# EasyEDA schematic schematic.json
TITLE: Sheet_1; REV: 1.0; Date: 2025-04-03; Sheet: 1/1; Drawn By: sahilchess09; Company: Your Company
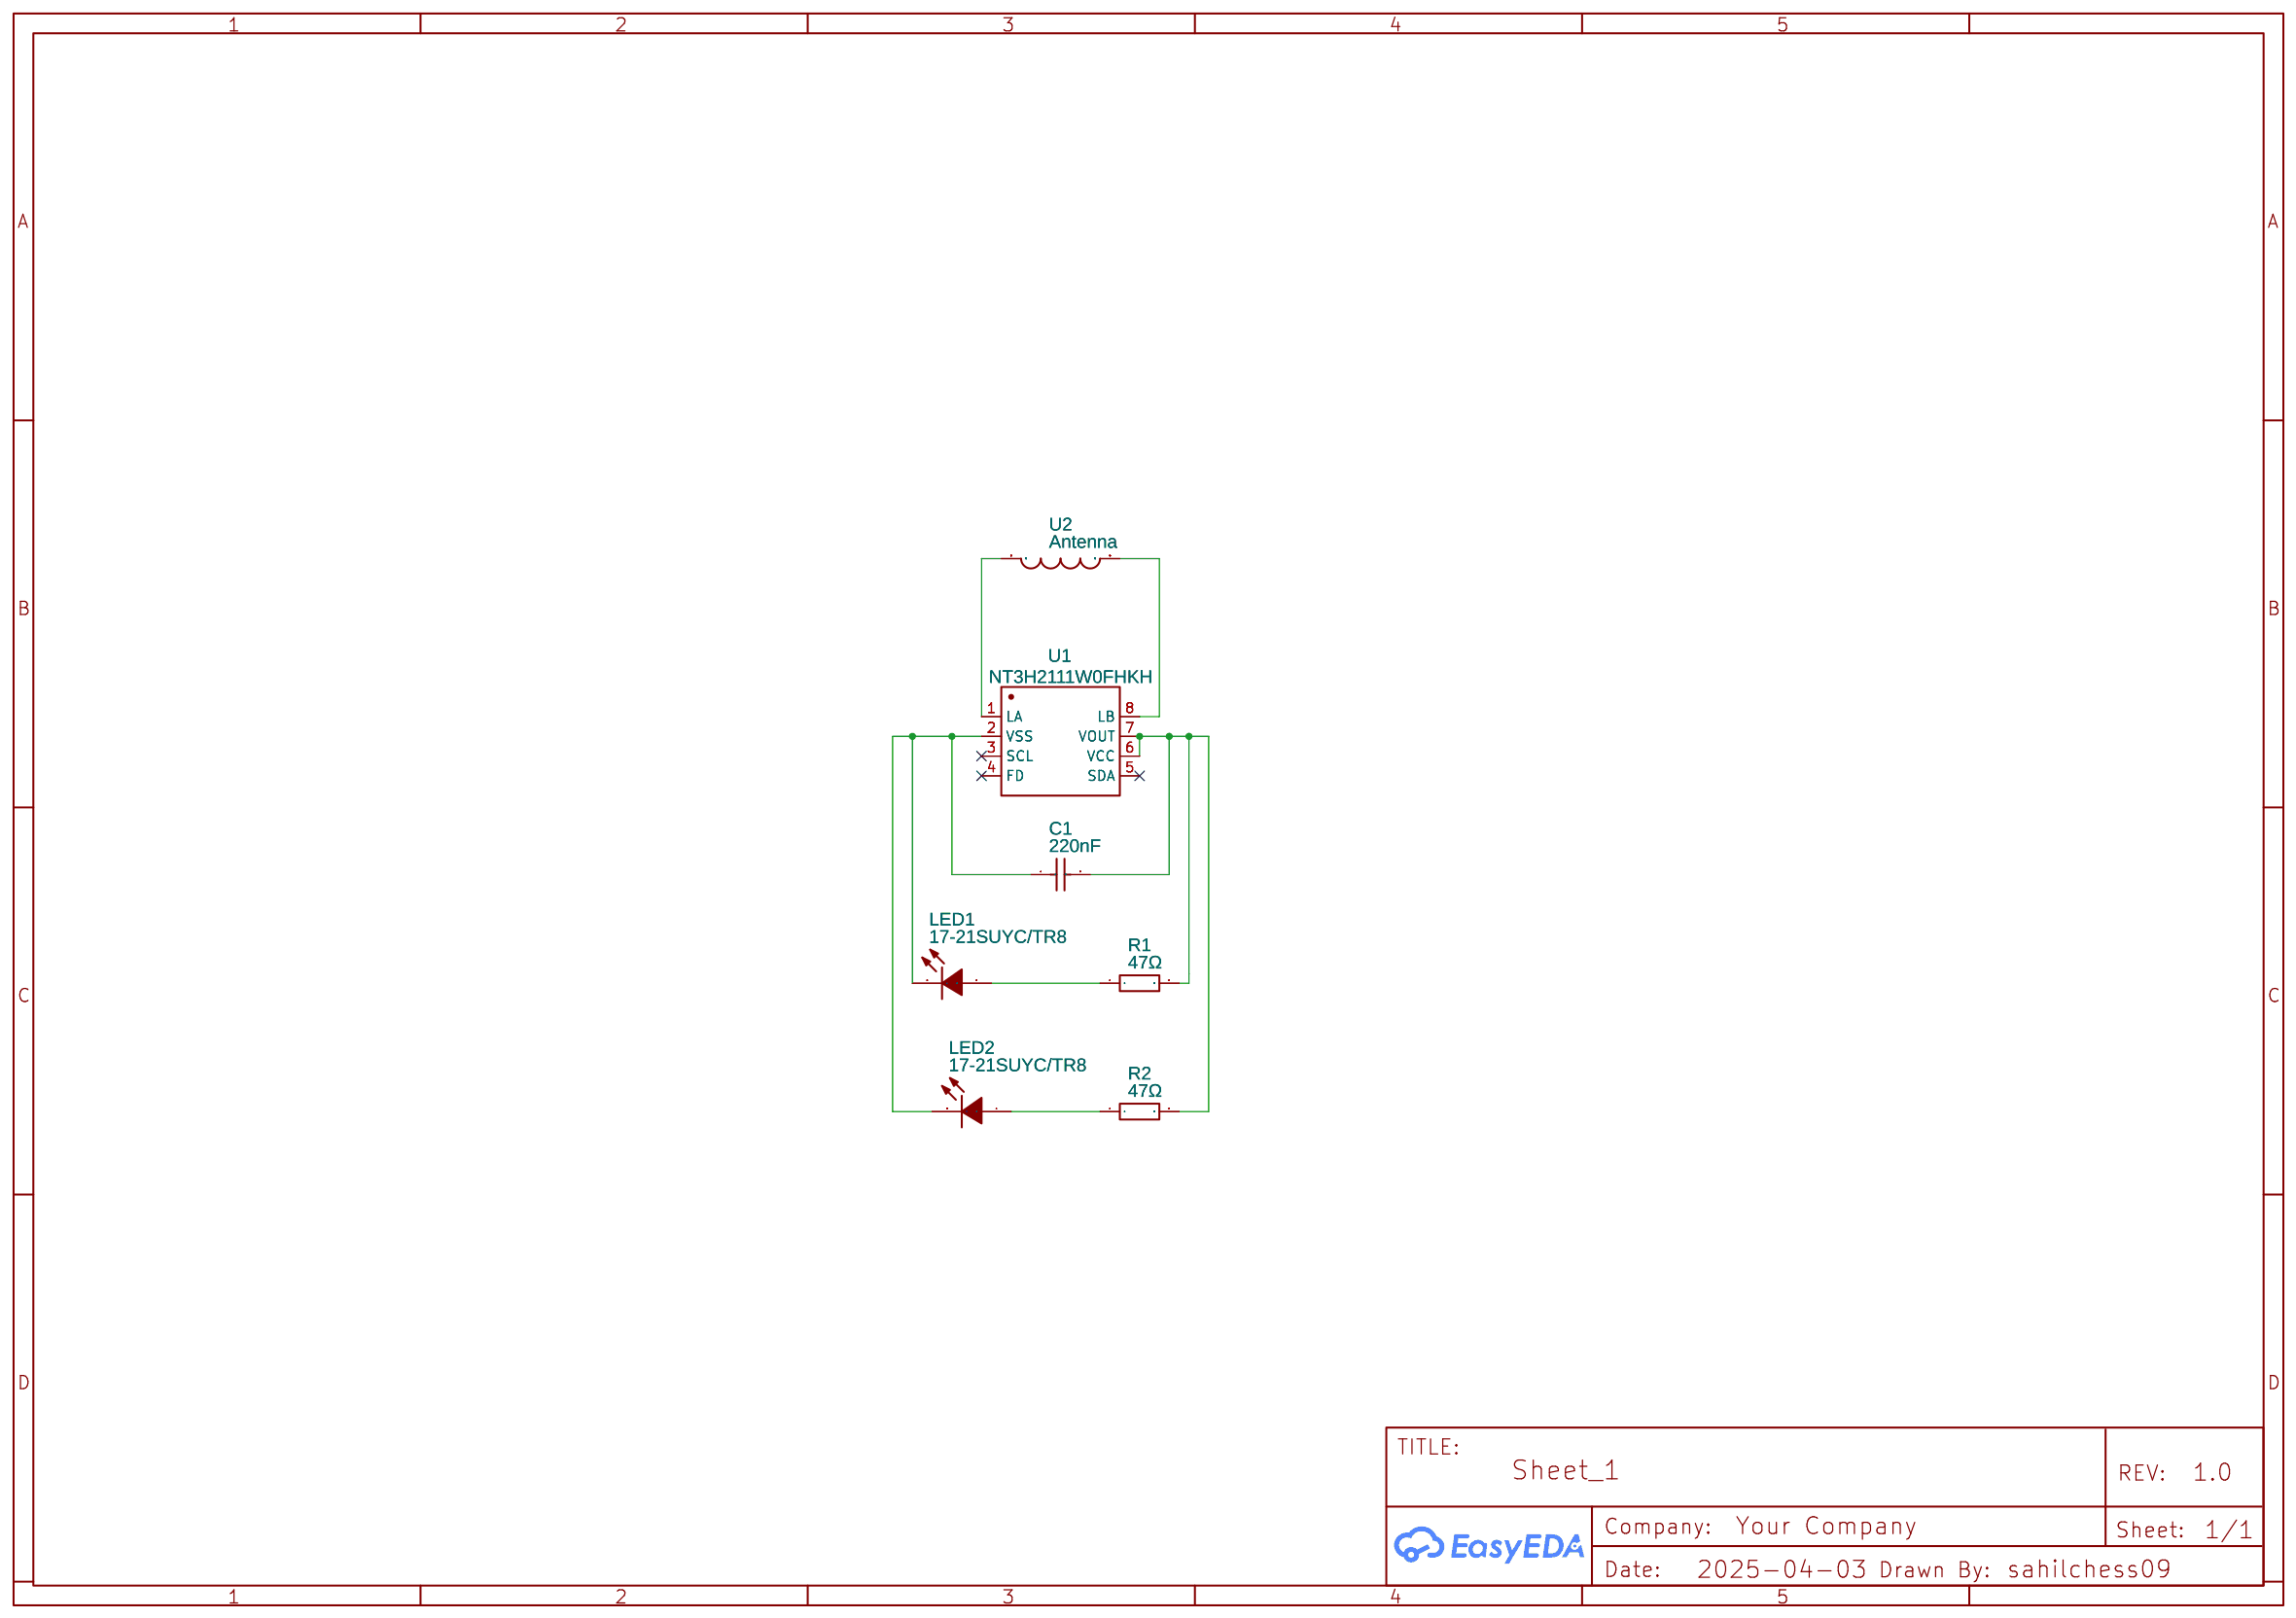
[diagram p0: schematic sheet]

## Parts
C1  220nF  [C0603]
LED1  17-21SUYC/TR8  [LED0805-R-RD]
LED2  17-21SUYC/TR8  [LED0805-R-RD]
R1  47Ω  [R0603]
R2  47Ω  [R0603]
U1  NT3H2111W0FHKH  [XQFN-8_L1.6-W1.6-P0.50-BL_NT3H2111W0FHKH]
U2  Antenna  [25X48MM_NFC_ANTENNA]

## Library data of the parts
C1 = CL10B224KA8NNNC: Supplier: LCSC; Manufacturer: SAMSUNG(三星); Supplier Part: C21120; JLCPCB Part Class: Basic Part
LED1 LED2 = 17-21SUYC/TR8: Supplier: LCSC; Manufacturer: KENTO; Manufacturer Part: KT-0805黄灯; Supplier Part: C2296; JLCPCB Part Class: Basic Part
R1 R2 = 0603WAF470JT5E: Supplier: LCSC; Manufacturer: UNI-ROYAL(厚声); Supplier Part: C23182; JLCPCB Part Class: Basic Part
U1 = NT3H2111W0FHKH: Contributor: LCSC; Supplier: LCSC; Supplier Part: C710403; Manufacturer: NXP(恩智浦); JLCPCB Part Class: Extended Part
U2 = Antenna: Contributor: maggie.j.liu

## Nets
Net-(C1-1): C1.1 LED1.2(-) LED2.2(-) U1.2(VSS)
Net-(C1-2): C1.2 R1.2 R2.2 U1.6(VCC) U1.7(VOUT)
Net-(LED1-1): LED1.1(+) R1.1
Net-(LED2-1): LED2.1(+) R2.1
Net-(U1-1): U1.1(LA) U2.P$1
Net-(U1-8): U1.8(LB) U2.P$2

Not connected (* = marked no-connect by the designer): U1 3(SCL)* 4(FD)* 5(SDA)*
